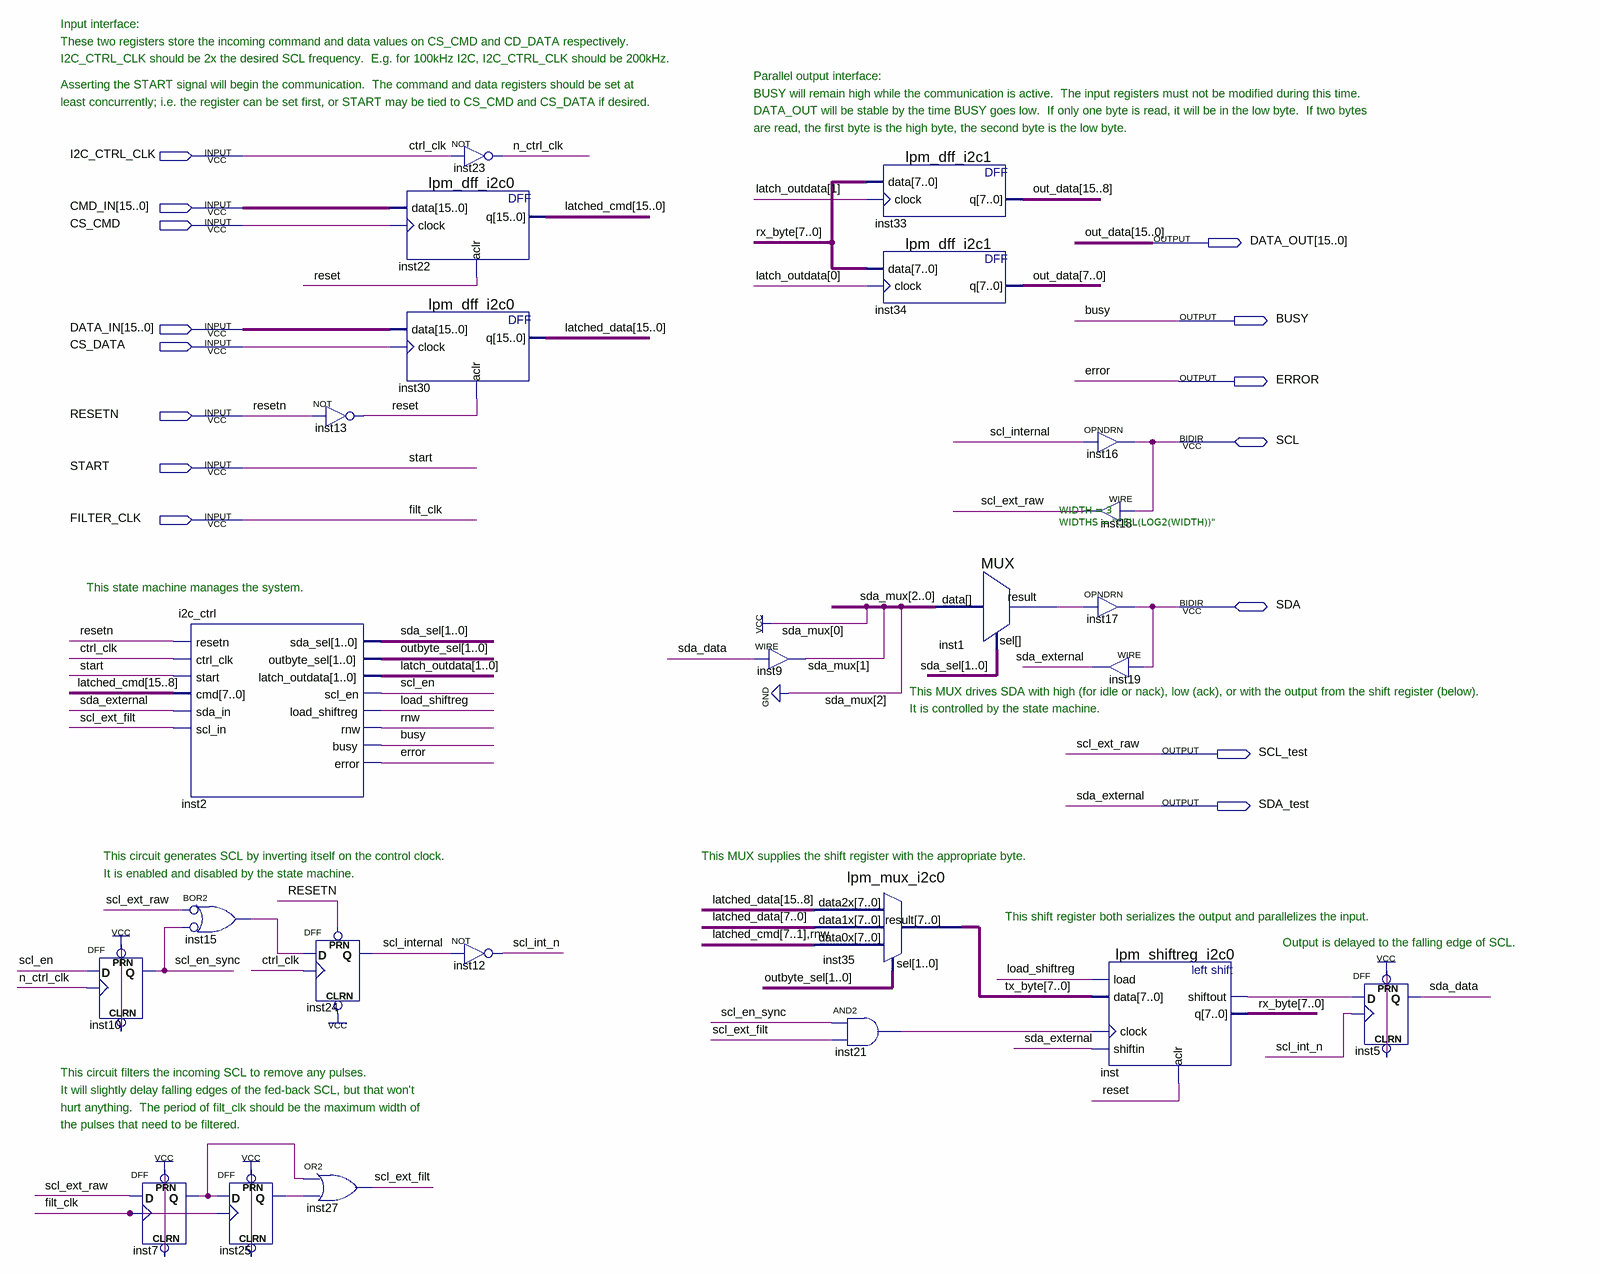
[diagram p0: schematic sheet]
// Quartus schematic I2C_master.bdf as structural Verilog: 24 symbols, 15 pins
module I2C_master (
  input  I2C_CTRL_CLK,
  input  [15:0] CMD_IN,
  input  CS_CMD,
  input  [15:0] DATA_IN,
  input  CS_DATA,
  input  RESETN,
  input  START,
  input  FILTER_CLK,
  inout  SCL,
  inout  SDA,
  output [15:0] DATA_OUT,
  output BUSY,
  output ERROR,
  output SCL_test,
  output SDA_test
);

  wire inst1_result, inst7_q, inst15_out, inst21_out, inst25_q, inst_shiftout, load_shiftreg, n_ctrl_clk,
       reset, rnw, scl_en, scl_en_sync, scl_ext_filt, scl_int_n, scl_internal, sda_data;
  wire [1:0] latch_outdata, outbyte_sel, sda_sel;
  wire [1:1] sda_mux;
  wire [7:0] rx_byte, tx_byte;
  wire [15:0] latched_cmd, latched_data;

  DFF inst10 (.CLRN(1'b1), .CLK(n_ctrl_clk), .D(scl_en), .PRN(1'b1), .Q(scl_en_sync));
  DFF inst7 (.CLRN(1'b1), .CLK(FILTER_CLK), .D(SCL_test), .PRN(1'b1), .Q(inst7_q));
  i2c_ctrl inst2 (
    .resetn(RESETN), .ctrl_clk(I2C_CTRL_CLK), .start(START), .cmd(latched_cmd[15:8]), .sda_in(SDA_test),
    .scl_in(scl_ext_filt), .sda_sel(sda_sel), .outbyte_sel(outbyte_sel), .latch_outdata(latch_outdata),
    .scl_en(scl_en), .load_shiftreg(load_shiftreg), .rnw(rnw), .busy(BUSY), .error(ERROR));
  or inst15 (inst15_out, ~SCL_test, ~scl_en_sync);  // BOR2
  DFF inst25 (.CLRN(1'b1), .CLK(FILTER_CLK), .D(inst7_q), .PRN(1'b1), .Q(inst25_q));
  DFF inst24 (.CLRN(1'b1), .CLK(I2C_CTRL_CLK), .D(inst15_out), .PRN(RESETN), .Q(scl_internal));
  or inst27 (scl_ext_filt, inst7_q, inst25_q);
  not inst13 (reset, RESETN);
  lpm_dff_i2c0 inst22 (.data(CMD_IN), .clock(CS_CMD), .aclr(reset), .q(latched_cmd));
  lpm_dff_i2c0 inst30 (.data(DATA_IN), .clock(CS_DATA), .aclr(reset), .q(latched_data));
  not inst23 (n_ctrl_clk, I2C_CTRL_CLK);
  not inst12 (scl_int_n, scl_internal);
  assign sda_mux[1] = sda_data;  // WIRE inst9
  lpm_mux_i2c0 inst35 (
    .data2x(latched_data[15:8]), .data1x(latched_data[7:0]), .data0x({latched_cmd[7:1], rnw}),
    .sel(outbyte_sel), .result(tx_byte));
  and inst21 (inst21_out, scl_en_sync, scl_ext_filt);
  lpm_dff_i2c1 inst33 (.data(rx_byte), .clock(latch_outdata[1]), .q(DATA_OUT[15:8]));
  lpm_dff_i2c1 inst34 (.data(rx_byte), .clock(latch_outdata[0]), .q(DATA_OUT[7:0]));
  MUX #(.WIDTH(3), .WIDTHS("CEIL(LOG2(WIDTH))")) inst1 (
    .data({1'b0, sda_mux[1], 1'b1}), .sel(sda_sel), .result(inst1_result));
  OPNDRN inst16 (.IN(scl_internal), .OUT(SCL));
  assign SCL_test = SCL;  // WIRE inst18
  OPNDRN inst17 (.IN(inst1_result), .OUT(SDA));
  assign SDA_test = SDA;  // WIRE inst19
  lpm_shiftreg_i2c0 inst (
    .load(load_shiftreg), .data(tx_byte), .clock(inst21_out), .shiftin(SDA_test), .aclr(reset),
    .shiftout(inst_shiftout), .q(rx_byte));
  DFF inst5 (.CLRN(1'b1), .CLK(scl_int_n), .D(inst_shiftout), .PRN(1'b1), .Q(sda_data));

  // Other names for the same wires on the sheet: ctrl_clk = I2C_CTRL_CLK; filt_clk = FILTER_CLK;
  //   out_data[15:0] = DATA_OUT; scl_ext_raw = SCL_test; sda_external = SDA_test

  // Notes on the sheet:
  //   Input interface:
  //   These two registers store the incoming command and data values on CS_CMD and CD_DATA respectively.
  //   I2C_CTRL_CLK should be 2x the desired SCL frequency.  E.g. for 100kHz I2C, I2C_CTRL_CLK should be 200kHz.
  //   Parallel output interface:
  //   Asserting the START signal will begin the communication.  The command and data registers should be set at
  //   BUSY will remain high while the communication is active.  The input registers must not be modified during this time.
  //   least concurrently; i.e. the register can be set first, or START may be tied to CS_CMD and CS_DATA if desired.
  //   DATA_OUT will be stable by the time BUSY goes low.  If only one byte is read, it will be in the low byte.  If two bytes
  //   are read, the first byte is the high byte, the second byte is the low byte.
  //   This state machine manages the system.
  //   This MUX drives SDA with high (for idle or nack), low (ack), or with the output from the shift register (below).
  //   It is controlled by the state machine.
  //   This circuit generates SCL by inverting itself on the control clock.
  //   This MUX supplies the shift register with the appropriate byte.
  //   It is enabled and disabled by the state machine.
  //   This shift register both serializes the output and parallelizes the input.
  //   Output is delayed to the falling edge of SCL.
  //   This circuit filters the incoming SCL to remove any pulses.
  //   It will slightly delay falling edges of the fed-back SCL, but that won't
  //   hurt anything.  The period of filt_clk should be the maximum width of
  //   the pulses that need to be filtered.
endmodule
